# Altium project sigjumper-bottom.PrjPcb
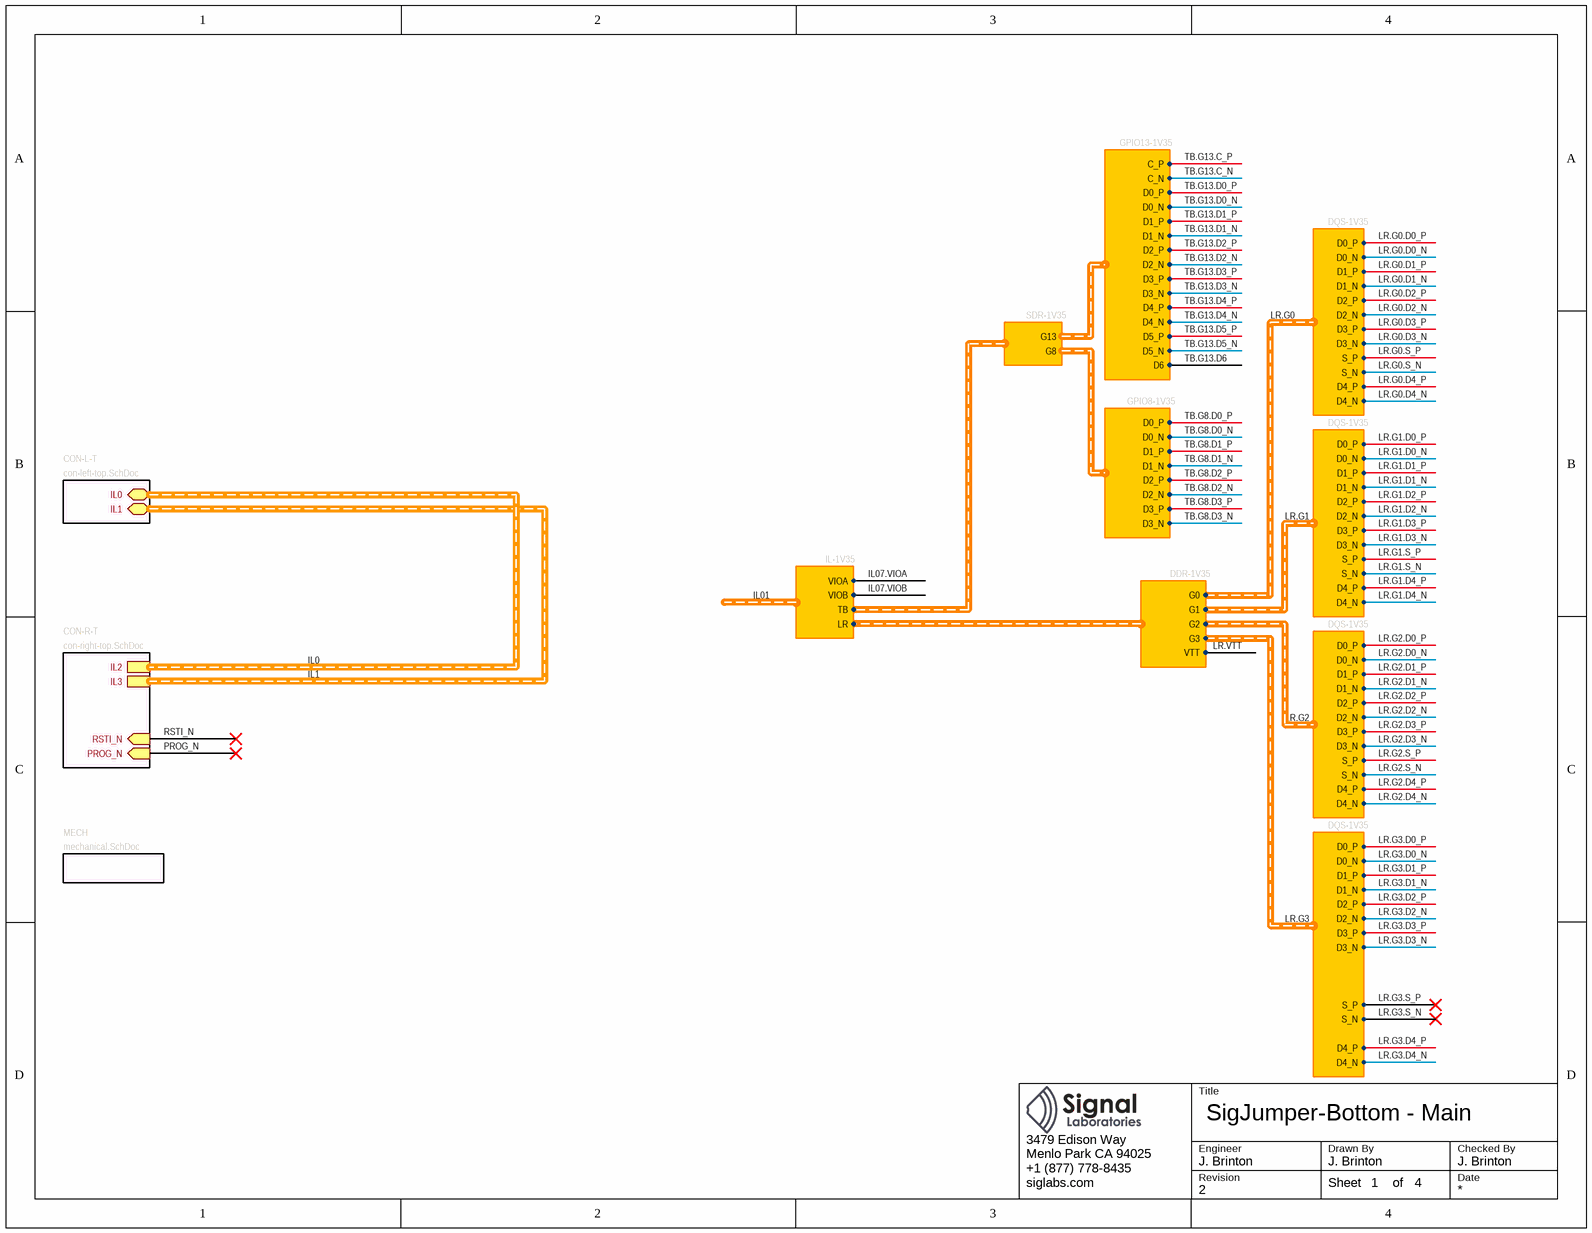
[diagram p0: main.SchDoc]
4 sheets, 24 parts. Net scope: hierarchical (ports join the sheet entries above them; power ports are global).
Board file: sigjumper-bottom.PcbDoc
Sheets:
  main.SchDoc
    CON-L-T = con-left-top.SchDoc
    CON-R-T = con-right-top.SchDoc
    MECH = mechanical.SchDoc

## Sheet main.SchDoc: SigJumper-Bottom - Main
size Letter; CheckedBy: J. Brinton; CompanyName: Signal Laboratories, Inc.; DrawnBy: J. Brinton; Engineer: J. Brinton; Address1: 3479 Edison Way; Address2: Menlo Park CA 94025; Address3: +1 (877) 778-8435; Address4: siglabs.com; Revision: 2; SheetNumber: 1; SheetTotal: 4

### Sub-sheets
CON-L-T = con-left-top.SchDoc: IL0 (harness IL-1V35), IL1 (harness IL-1V35)
CON-R-T = con-right-top.SchDoc: IL3 (harness IL-1V35), RSTI_N (in), PROG_N (in), IL2 (harness IL-1V35)
MECH = mechanical.SchDoc: no entries

### Harnesses
GPIO8-1V35: D0_P, D0_N, D1_P, D1_N, D2_P, D2_N, D3_P, D3_N
SDR-1V35: G13, G8
GPIO13-1V35: C_P, C_N, D0_P, D0_N, D1_P, D1_N, D2_P, D2_N, D3_P, D3_N, D4_P, D4_N, D5_P, D5_N, D6
DQS-1V35: D0_P, D0_N, D1_P, D1_N, D2_P, D2_N, D3_P, D3_N, D4_P, D4_N, S_P, S_N
DDR-1V35: G0, G1, G2, G3, VTT
IL-1V35: LR, TB, VIOA, VIOB

### Nets
IL07.VIOA: harness IL-1V35.VIOA  [project net IL01.VIOA]
IL07.VIOB: harness IL-1V35.VIOB  [project net IL01.VIOB]
LR.G0.D0_N: harness DQS-1V35.D0_N
LR.G0.D0_P: harness DQS-1V35.D0_P
LR.G0.D1_N: harness DQS-1V35.D1_N
LR.G0.D1_P: harness DQS-1V35.D1_P
LR.G0.D2_N: harness DQS-1V35.D2_N
LR.G0.D2_P: harness DQS-1V35.D2_P
LR.G0.D3_N: harness DQS-1V35.D3_N
LR.G0.D3_P: harness DQS-1V35.D3_P
LR.G0.D4_N: harness DQS-1V35.D4_N
LR.G0.D4_P: harness DQS-1V35.D4_P
LR.G0.S_N: harness DQS-1V35.S_N
LR.G0.S_P: harness DQS-1V35.S_P
LR.G1.D0_N: harness DQS-1V35.D0_N
LR.G1.D0_P: harness DQS-1V35.D0_P
LR.G1.D1_N: harness DQS-1V35.D1_N
LR.G1.D1_P: harness DQS-1V35.D1_P
LR.G1.D2_N: harness DQS-1V35.D2_N
LR.G1.D2_P: harness DQS-1V35.D2_P
LR.G1.D3_N: harness DQS-1V35.D3_N
LR.G1.D3_P: harness DQS-1V35.D3_P
LR.G1.D4_N: harness DQS-1V35.D4_N
LR.G1.D4_P: harness DQS-1V35.D4_P
LR.G1.S_N: harness DQS-1V35.S_N
LR.G1.S_P: harness DQS-1V35.S_P
LR.G2.D0_N: harness DQS-1V35.D0_N
LR.G2.D0_P: harness DQS-1V35.D0_P
LR.G2.D1_N: harness DQS-1V35.D1_N
LR.G2.D1_P: harness DQS-1V35.D1_P
LR.G2.D2_N: harness DQS-1V35.D2_N
LR.G2.D2_P: harness DQS-1V35.D2_P
LR.G2.D3_N: harness DQS-1V35.D3_N
LR.G2.D3_P: harness DQS-1V35.D3_P
LR.G2.D4_N: harness DQS-1V35.D4_N
LR.G2.D4_P: harness DQS-1V35.D4_P
LR.G2.S_N: harness DQS-1V35.S_N
LR.G2.S_P: harness DQS-1V35.S_P
LR.G3.D0_N: harness DQS-1V35.D0_N
LR.G3.D0_P: harness DQS-1V35.D0_P
LR.G3.D1_N: harness DQS-1V35.D1_N
LR.G3.D1_P: harness DQS-1V35.D1_P
LR.G3.D2_N: harness DQS-1V35.D2_N
LR.G3.D2_P: harness DQS-1V35.D2_P
LR.G3.D3_N: harness DQS-1V35.D3_N
LR.G3.D3_P: harness DQS-1V35.D3_P
LR.G3.D4_N: harness DQS-1V35.D4_N
LR.G3.D4_P: harness DQS-1V35.D4_P
LR.G3.S_N: harness DQS-1V35.S_N
LR.G3.S_P: harness DQS-1V35.S_P
LR.VTT: harness DDR-1V35.VTT
TB.G8.D0_N: harness GPIO8-1V35.D0_N
TB.G8.D0_P: harness GPIO8-1V35.D0_P
TB.G8.D1_N: harness GPIO8-1V35.D1_N
TB.G8.D1_P: harness GPIO8-1V35.D1_P
TB.G8.D2_N: harness GPIO8-1V35.D2_N
TB.G8.D2_P: harness GPIO8-1V35.D2_P
TB.G8.D3_N: harness GPIO8-1V35.D3_N
TB.G8.D3_P: harness GPIO8-1V35.D3_P
TB.G13.C_N: harness GPIO13-1V35.C_N
TB.G13.C_P: harness GPIO13-1V35.C_P
TB.G13.D0_N: harness GPIO13-1V35.D0_N
TB.G13.D0_P: harness GPIO13-1V35.D0_P
TB.G13.D1_N: harness GPIO13-1V35.D1_N
TB.G13.D1_P: harness GPIO13-1V35.D1_P
TB.G13.D2_N: harness GPIO13-1V35.D2_N
TB.G13.D2_P: harness GPIO13-1V35.D2_P
TB.G13.D3_N: harness GPIO13-1V35.D3_N
TB.G13.D3_P: harness GPIO13-1V35.D3_P
TB.G13.D4_N: harness GPIO13-1V35.D4_N
TB.G13.D4_P: harness GPIO13-1V35.D4_P
TB.G13.D5_N: harness GPIO13-1V35.D5_N
TB.G13.D5_P: harness GPIO13-1V35.D5_P
TB.G13.D6: harness GPIO13-1V35.D6

### Buses and harness runs
harness IL0 = sheet CON-L-T/IL0 = sheet CON-R-T/IL2
harness IL1 = sheet CON-L-T/IL1 = sheet CON-R-T/IL3

### Notes on the sheet
- Title
- Engineer
- Revision
- Drawn By
- Checked By
- Date
- Sheet
- of

## Sheet con-left-top.SchDoc: SigJumper-Bottom - Left Top
size Letter; CheckedBy: J. Brinton; CompanyName: Signal Laboratories, Inc.; DrawnBy: J. Brinton; Engineer: J. Brinton; Address1: 3479 Edison Way; Address2: Menlo Park CA 94025; Address3: +1 (877) 778-8435; Address4: siglabs.com; Revision: 2; SheetNumber: 4; SheetTotal: 4
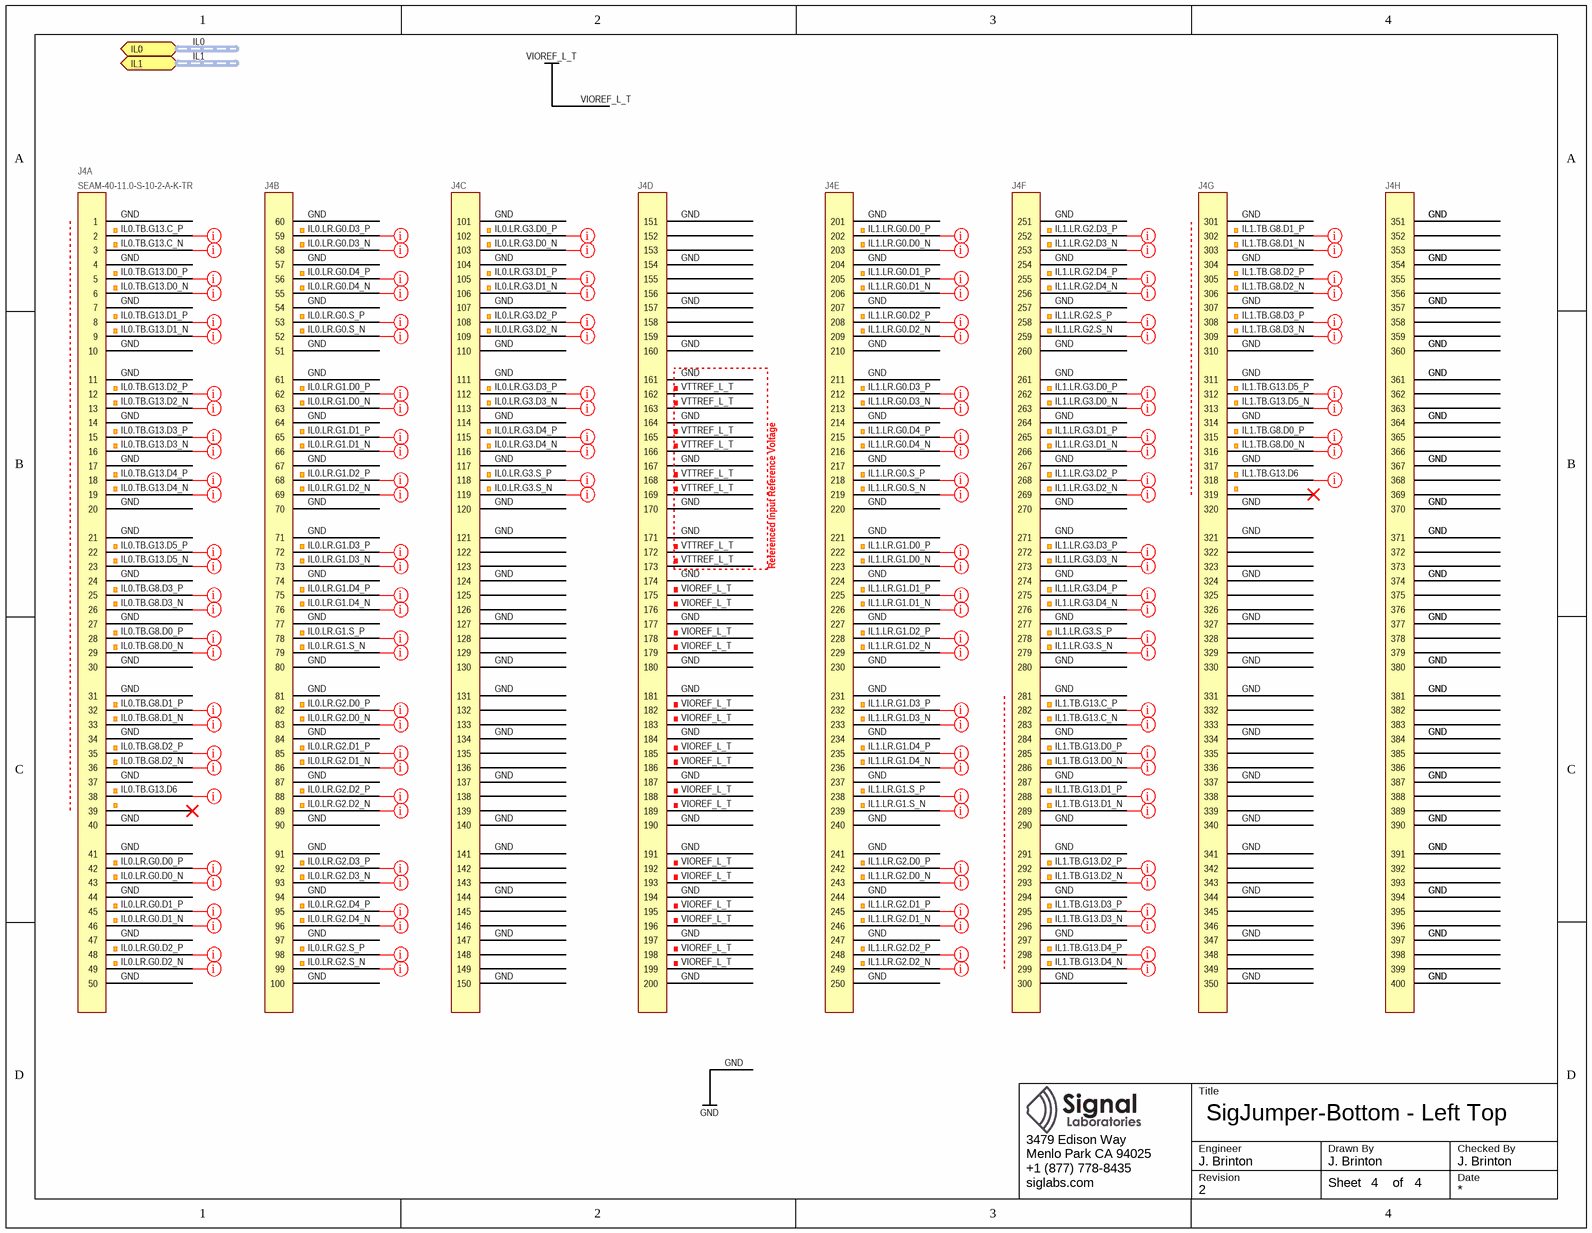
[diagram p1: con-left-top.SchDoc]

### Parts
J4  SEAM-40-11.0-S-10-2-A-K-TR  [SEAM-40-11.0-S-10-2-A-K-TR]  (parts A,B,C,D,E,F,G,H of 8)

### Ports
IL0 (harness IL-1V35), IL1 (harness IL-1V35)

### Nets
GND: J4.1 J4.4 J4.7 J4.10 J4.11 J4.14 J4.17 J4.20 J4.21 J4.24 J4.27 J4.30 J4.31 J4.34 J4.37 J4.40 J4.41 J4.44 J4.47 J4.50 J4.51 J4.54 J4.57 J4.60 J4.61 J4.64 J4.67 J4.70 J4.71 J4.74 J4.77 J4.80 J4.81 J4.84 J4.87 J4.90 J4.91 J4.94 J4.97 J4.100 J4.101 J4.104 J4.107 J4.110 J4.111 J4.114 J4.117 J4.120 J4.121 J4.124 J4.127 J4.130 J4.131 J4.134 J4.137 J4.140 J4.141 J4.144 J4.147 J4.150 J4.151 J4.154 J4.157 J4.160 J4.161 J4.164 J4.167 J4.170 J4.171 J4.174 J4.177 J4.180 J4.181 J4.184 J4.187 J4.190 J4.191 J4.194 J4.197 J4.200 J4.201 J4.204 J4.207 J4.210 J4.211 J4.214 J4.217 J4.220 J4.221 J4.224 J4.227 J4.230 J4.231 J4.234 J4.237 J4.240 J4.241 J4.244 J4.247 J4.250 J4.251 J4.254 J4.257 J4.260 J4.261 J4.264 J4.267 J4.270 J4.271 J4.274 J4.277 J4.280 J4.281 J4.284 J4.287 J4.290 J4.291 J4.294 J4.297 J4.300 J4.301 J4.304 J4.307 J4.310 J4.311 J4.314 J4.317 J4.320 J4.321 J4.324 J4.327 J4.330 J4.331 J4.334 J4.337 J4.340 J4.341 J4.344 J4.347 J4.350 J4.351 J4.354 J4.357 J4.360 J4.361 J4.364 J4.367 J4.370 J4.371 J4.374 J4.377 J4.380 J4.381 J4.384 J4.387 J4.390 J4.391 J4.394 J4.397 J4.400
VIOREF_L_T: J4.175 J4.176 J4.178 J4.179 J4.182 J4.183 J4.185 J4.186 J4.188 J4.189 J4.192 J4.193 J4.195 J4.196 J4.198 J4.199
IL0.LR.G0.D0_N: J4.43
IL0.LR.G0.D0_P: J4.42
IL0.LR.G0.D1_N: J4.46
IL0.LR.G0.D1_P: J4.45
IL0.LR.G0.D2_N: J4.49
IL0.LR.G0.D2_P: J4.48
IL0.LR.G0.D3_N: J4.58
IL0.LR.G0.D3_P: J4.59
IL0.LR.G0.D4_N: J4.55
IL0.LR.G0.D4_P: J4.56
IL0.LR.G0.S_N: J4.52
IL0.LR.G0.S_P: J4.53
IL0.LR.G1.D0_N: J4.63
IL0.LR.G1.D0_P: J4.62
IL0.LR.G1.D1_N: J4.66
IL0.LR.G1.D1_P: J4.65
IL0.LR.G1.D2_N: J4.69
IL0.LR.G1.D2_P: J4.68
IL0.LR.G1.D3_N: J4.73
IL0.LR.G1.D3_P: J4.72
IL0.LR.G1.D4_N: J4.76
IL0.LR.G1.D4_P: J4.75
IL0.LR.G1.S_N: J4.79
IL0.LR.G1.S_P: J4.78
IL0.LR.G2.D0_N: J4.83
IL0.LR.G2.D0_P: J4.82
IL0.LR.G2.D1_N: J4.86
IL0.LR.G2.D1_P: J4.85
IL0.LR.G2.D2_N: J4.89
IL0.LR.G2.D2_P: J4.88
IL0.LR.G2.D3_N: J4.93
IL0.LR.G2.D3_P: J4.92
IL0.LR.G2.D4_N: J4.96
IL0.LR.G2.D4_P: J4.95
IL0.LR.G2.S_N: J4.99
IL0.LR.G2.S_P: J4.98
IL0.LR.G3.D0_N: J4.103
IL0.LR.G3.D0_P: J4.102
IL0.LR.G3.D1_N: J4.106
IL0.LR.G3.D1_P: J4.105
IL0.LR.G3.D2_N: J4.109
IL0.LR.G3.D2_P: J4.108
IL0.LR.G3.D3_N: J4.113
IL0.LR.G3.D3_P: J4.112
IL0.LR.G3.D4_N: J4.116
IL0.LR.G3.D4_P: J4.115
IL0.LR.G3.S_N: J4.119
IL0.LR.G3.S_P: J4.118
IL0.TB.G8.D0_N: J4.29
IL0.TB.G8.D0_P: J4.28
IL0.TB.G8.D1_N: J4.33
IL0.TB.G8.D1_P: J4.32
IL0.TB.G8.D2_N: J4.36
IL0.TB.G8.D2_P: J4.35
IL0.TB.G8.D3_N: J4.26
IL0.TB.G8.D3_P: J4.25
IL0.TB.G13.C_N: J4.3
IL0.TB.G13.C_P: J4.2
IL0.TB.G13.D0_N: J4.6
IL0.TB.G13.D0_P: J4.5
IL0.TB.G13.D1_N: J4.9
IL0.TB.G13.D1_P: J4.8
IL0.TB.G13.D2_N: J4.13
IL0.TB.G13.D2_P: J4.12
IL0.TB.G13.D3_N: J4.16
IL0.TB.G13.D3_P: J4.15
IL0.TB.G13.D4_N: J4.19
IL0.TB.G13.D4_P: J4.18
IL0.TB.G13.D5_N: J4.23
IL0.TB.G13.D5_P: J4.22
IL0.TB.G13.D6: J4.38
IL1.LR.G0.D0_N: J4.203
IL1.LR.G0.D0_P: J4.202
IL1.LR.G0.D1_N: J4.206
IL1.LR.G0.D1_P: J4.205
IL1.LR.G0.D2_N: J4.209
IL1.LR.G0.D2_P: J4.208
IL1.LR.G0.D3_N: J4.213
IL1.LR.G0.D3_P: J4.212
IL1.LR.G0.D4_N: J4.216
IL1.LR.G0.D4_P: J4.215
IL1.LR.G0.S_N: J4.219
IL1.LR.G0.S_P: J4.218
IL1.LR.G1.D0_N: J4.223
IL1.LR.G1.D0_P: J4.222
IL1.LR.G1.D1_N: J4.226
IL1.LR.G1.D1_P: J4.225
IL1.LR.G1.D2_N: J4.229
IL1.LR.G1.D2_P: J4.228
IL1.LR.G1.D3_N: J4.233
IL1.LR.G1.D3_P: J4.232
IL1.LR.G1.D4_N: J4.236
IL1.LR.G1.D4_P: J4.235
IL1.LR.G1.S_N: J4.239
IL1.LR.G1.S_P: J4.238
IL1.LR.G2.D0_N: J4.243
IL1.LR.G2.D0_P: J4.242
IL1.LR.G2.D1_N: J4.246
IL1.LR.G2.D1_P: J4.245
IL1.LR.G2.D2_N: J4.249
IL1.LR.G2.D2_P: J4.248
IL1.LR.G2.D3_N: J4.253
IL1.LR.G2.D3_P: J4.252
IL1.LR.G2.D4_N: J4.256
IL1.LR.G2.D4_P: J4.255
IL1.LR.G2.S_N: J4.259
IL1.LR.G2.S_P: J4.258
IL1.LR.G3.D0_N: J4.263
IL1.LR.G3.D0_P: J4.262
IL1.LR.G3.D1_N: J4.266
IL1.LR.G3.D1_P: J4.265
IL1.LR.G3.D2_N: J4.269
IL1.LR.G3.D2_P: J4.268
IL1.LR.G3.D3_N: J4.273
IL1.LR.G3.D3_P: J4.272
IL1.LR.G3.D4_N: J4.276
IL1.LR.G3.D4_P: J4.275
IL1.LR.G3.S_N: J4.279
IL1.LR.G3.S_P: J4.278
IL1.TB.G8.D0_N: J4.316
IL1.TB.G8.D0_P: J4.315
IL1.TB.G8.D1_N: J4.303
IL1.TB.G8.D1_P: J4.302
IL1.TB.G8.D2_N: J4.306
IL1.TB.G8.D2_P: J4.305
IL1.TB.G8.D3_N: J4.309
IL1.TB.G8.D3_P: J4.308
IL1.TB.G13.C_N: J4.283
IL1.TB.G13.C_P: J4.282
IL1.TB.G13.D0_N: J4.286
IL1.TB.G13.D0_P: J4.285
IL1.TB.G13.D1_N: J4.289
IL1.TB.G13.D1_P: J4.288
IL1.TB.G13.D2_N: J4.293
IL1.TB.G13.D2_P: J4.292
IL1.TB.G13.D3_N: J4.296
IL1.TB.G13.D3_P: J4.295
IL1.TB.G13.D4_N: J4.299
IL1.TB.G13.D4_P: J4.298
IL1.TB.G13.D5_N: J4.313
IL1.TB.G13.D5_P: J4.312
IL1.TB.G13.D6: J4.318
VTTREF_L_T: J4.162 J4.163 J4.165 J4.166 J4.168 J4.169 J4.172 J4.173

Not connected (* = marked no-connect by the designer): J4 39* 122 123 125 126 128 129 132 133 135 136 138 139 142 143 145 146 148 149 152 153 155 156 158 159 319* 322 323 325 326 328 329 332 333 335 336 338 339 342 343 345 346 348 349 352 353 355 356 358 359 362 363 365 366 368 369 372 373 375 376 378 379 382 383 385 386 388 389 392 393 395 396 398 399

### Buses and harness runs
harness IL0 = port IL0
harness IL1 = port IL1

### Layout directives
net class z50; differential pair; net class loose: IL0.LR.G0.D0_N, IL0.LR.G0.D0_P, IL0.LR.G0.D1_N, IL0.LR.G0.D1_P, IL0.LR.G0.D2_N, IL0.LR.G0.D2_P, IL0.LR.G0.D3_N, IL0.LR.G0.D3_P, IL0.LR.G0.D4_N, IL0.LR.G0.D4_P, IL0.LR.G0.S_N, IL0.LR.G0.S_P, IL0.LR.G1.D0_N, IL0.LR.G1.D0_P, IL0.LR.G1.D1_N, IL0.LR.G1.D1_P, IL0.LR.G1.D2_N, IL0.LR.G1.D2_P, IL0.LR.G1.D3_N, IL0.LR.G1.D3_P, IL0.LR.G1.D4_N, IL0.LR.G1.D4_P, IL0.LR.G1.S_N, IL0.LR.G1.S_P, IL0.LR.G2.D0_N, IL0.LR.G2.D0_P, IL0.LR.G2.D1_N, IL0.LR.G2.D1_P, IL0.LR.G2.D2_N, IL0.LR.G2.D2_P, IL0.LR.G2.D3_N, IL0.LR.G2.D3_P, IL0.LR.G2.D4_N, IL0.LR.G2.D4_P, IL0.LR.G2.S_N, IL0.LR.G2.S_P, IL0.LR.G3.D0_N, IL0.LR.G3.D0_P, IL0.LR.G3.D1_N, IL0.LR.G3.D1_P, IL0.LR.G3.D2_N, IL0.LR.G3.D2_P, IL0.LR.G3.D3_N, IL0.LR.G3.D3_P, IL0.LR.G3.D4_N, IL0.LR.G3.D4_P, IL0.LR.G3.S_N, IL0.LR.G3.S_P, IL0.TB.G8.D0_N, IL0.TB.G8.D0_P, IL0.TB.G8.D1_N, IL0.TB.G8.D1_P, IL0.TB.G8.D2_N, IL0.TB.G8.D2_P, IL0.TB.G8.D3_N, IL0.TB.G8.D3_P, IL0.TB.G13.C_N, IL0.TB.G13.C_P, IL0.TB.G13.D0_N, IL0.TB.G13.D0_P, IL0.TB.G13.D1_N, IL0.TB.G13.D1_P, IL0.TB.G13.D2_N, IL0.TB.G13.D2_P, IL0.TB.G13.D3_N, IL0.TB.G13.D3_P, IL0.TB.G13.D4_N, IL0.TB.G13.D4_P, IL0.TB.G13.D5_N, IL0.TB.G13.D5_P, IL1.LR.G0.D0_N, IL1.LR.G0.D0_P, IL1.LR.G0.D1_N, IL1.LR.G0.D1_P, IL1.LR.G0.D2_N, IL1.LR.G0.D2_P, IL1.LR.G0.D3_N, IL1.LR.G0.D3_P, IL1.LR.G0.D4_N, IL1.LR.G0.D4_P, IL1.LR.G0.S_N, IL1.LR.G0.S_P, IL1.LR.G1.D0_N, IL1.LR.G1.D0_P, IL1.LR.G1.D1_N, IL1.LR.G1.D1_P, IL1.LR.G1.D2_N, IL1.LR.G1.D2_P, IL1.LR.G1.D3_N, IL1.LR.G1.D3_P, IL1.LR.G1.D4_N, IL1.LR.G1.D4_P, IL1.LR.G1.S_N, IL1.LR.G1.S_P, IL1.LR.G2.D0_N, IL1.LR.G2.D0_P, IL1.LR.G2.D1_N, IL1.LR.G2.D1_P, IL1.LR.G2.D2_N, IL1.LR.G2.D2_P, IL1.LR.G2.D3_N, IL1.LR.G2.D3_P, IL1.LR.G2.D4_N, IL1.LR.G2.D4_P, IL1.LR.G2.S_N, IL1.LR.G2.S_P, IL1.LR.G3.D0_N, IL1.LR.G3.D0_P, IL1.LR.G3.D1_N, IL1.LR.G3.D1_P, IL1.LR.G3.D2_N, IL1.LR.G3.D2_P, IL1.LR.G3.D3_N, IL1.LR.G3.D3_P, IL1.LR.G3.D4_N, IL1.LR.G3.D4_P, IL1.LR.G3.S_N, IL1.LR.G3.S_P, IL1.TB.G8.D0_N, IL1.TB.G8.D0_P, IL1.TB.G8.D1_N, IL1.TB.G8.D1_P, IL1.TB.G8.D2_N, IL1.TB.G8.D2_P, IL1.TB.G8.D3_N, IL1.TB.G8.D3_P, IL1.TB.G13.C_N, IL1.TB.G13.C_P, IL1.TB.G13.D0_N, IL1.TB.G13.D0_P, IL1.TB.G13.D1_N, IL1.TB.G13.D1_P, IL1.TB.G13.D2_N, IL1.TB.G13.D2_P, IL1.TB.G13.D3_N, IL1.TB.G13.D3_P, IL1.TB.G13.D4_N, IL1.TB.G13.D4_P, IL1.TB.G13.D5_N, IL1.TB.G13.D5_P
net class z50: IL0.TB.G13.D6, IL1.TB.G13.D6

### Notes on the sheet
- Referenced Input Reference Voltage
- Title
- Engineer
- Revision
- Drawn By
- Checked By
- Date
- Sheet
- of

### Library data of the parts
J4 = SEAM-40-11.0-S-10-2-A-K-TR: Terminal Array Assembly, Surface Mount, 0.050" Pitch, 400 Pins; Manufacturer: Samtec; Manufacturer P/N: SEAM-40-11.0-S-10-2-A-K-TR

## Sheet con-right-top.SchDoc: SigJumper-Bottom - Right Top
size Letter; CheckedBy: J. Brinton; CompanyName: Signal Laboratories, Inc.; DrawnBy: J. Brinton; Engineer: J. Brinton; Address1: 3479 Edison Way; Address2: Menlo Park CA 94025; Address3: +1 (877) 778-8435; Address4: siglabs.com; Revision: 2; SheetNumber: 2; SheetTotal: 4
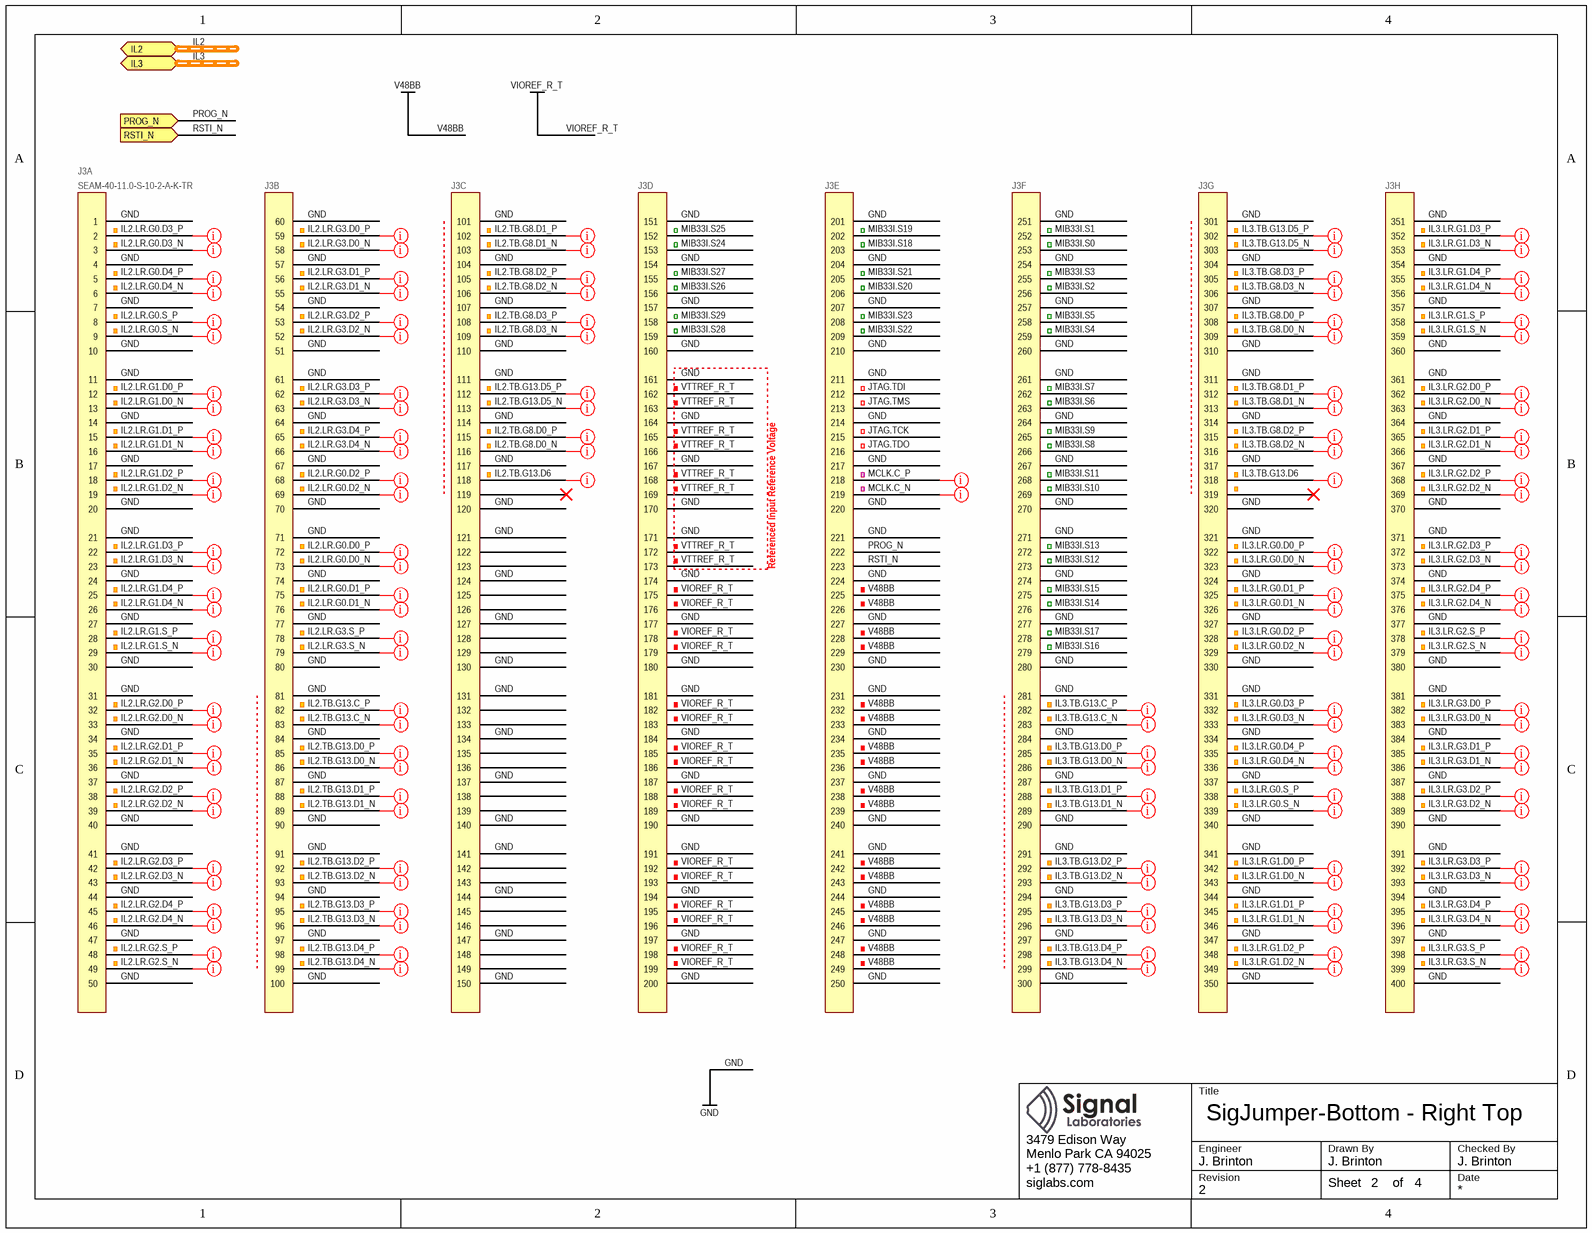
[diagram p2: con-right-top.SchDoc]

### Parts
J3  SEAM-40-11.0-S-10-2-A-K-TR  [SEAM-40-11.0-S-10-2-A-K-TR]  (parts A,B,C,D,E,F,G,H of 8)

### Ports
IL2 (harness IL-1V35), IL3 (harness IL-1V35), PROG_N (in), RSTI_N (in)

### Nets
GND: J3.1 J3.4 J3.7 J3.10 J3.11 J3.14 J3.17 J3.20 J3.21 J3.24 J3.27 J3.30 J3.31 J3.34 J3.37 J3.40 J3.41 J3.44 J3.47 J3.50 J3.51 J3.54 J3.57 J3.60 J3.61 J3.64 J3.67 J3.70 J3.71 J3.74 J3.77 J3.80 J3.81 J3.84 J3.87 J3.90 J3.91 J3.94 J3.97 J3.100 J3.101 J3.104 J3.107 J3.110 J3.111 J3.114 J3.117 J3.120 J3.121 J3.124 J3.127 J3.130 J3.131 J3.134 J3.137 J3.140 J3.141 J3.144 J3.147 J3.150 J3.151 J3.154 J3.157 J3.160 J3.161 J3.164 J3.167 J3.170 J3.171 J3.174 J3.177 J3.180 J3.181 J3.184 J3.187 J3.190 J3.191 J3.194 J3.197 J3.200 J3.201 J3.204 J3.207 J3.210 J3.211 J3.214 J3.217 J3.220 J3.221 J3.224 J3.227 J3.230 J3.231 J3.234 J3.237 J3.240 J3.241 J3.244 J3.247 J3.250 J3.251 J3.254 J3.257 J3.260 J3.261 J3.264 J3.267 J3.270 J3.271 J3.274 J3.277 J3.280 J3.281 J3.284 J3.287 J3.290 J3.291 J3.294 J3.297 J3.300 J3.301 J3.304 J3.307 J3.310 J3.311 J3.314 J3.317 J3.320 J3.321 J3.324 J3.327 J3.330 J3.331 J3.334 J3.337 J3.340 J3.341 J3.344 J3.347 J3.350 J3.351 J3.354 J3.357 J3.360 J3.361 J3.364 J3.367 J3.370 J3.371 J3.374 J3.377 J3.380 J3.381 J3.384 J3.387 J3.390 J3.391 J3.394 J3.397 J3.400
V48BB: J3.225 J3.226 J3.228 J3.229 J3.232 J3.233 J3.235 J3.236 J3.238 J3.239 J3.242 J3.243 J3.245 J3.246 J3.248 J3.249
VIOREF_R_T: J3.175 J3.176 J3.178 J3.179 J3.182 J3.183 J3.185 J3.186 J3.188 J3.189 J3.192 J3.193 J3.195 J3.196 J3.198 J3.199
IL2.LR.G0.D0_N: J3.73
IL2.LR.G0.D0_P: J3.72
IL2.LR.G0.D1_N: J3.76
IL2.LR.G0.D1_P: J3.75
IL2.LR.G0.D2_N: J3.69
IL2.LR.G0.D2_P: J3.68
IL2.LR.G0.D3_N: J3.3
IL2.LR.G0.D3_P: J3.2
IL2.LR.G0.D4_N: J3.6
IL2.LR.G0.D4_P: J3.5
IL2.LR.G0.S_N: J3.9
IL2.LR.G0.S_P: J3.8
IL2.LR.G1.D0_N: J3.13
IL2.LR.G1.D0_P: J3.12
IL2.LR.G1.D1_N: J3.16
IL2.LR.G1.D1_P: J3.15
IL2.LR.G1.D2_N: J3.19
IL2.LR.G1.D2_P: J3.18
IL2.LR.G1.D3_N: J3.23
IL2.LR.G1.D3_P: J3.22
IL2.LR.G1.D4_N: J3.26
IL2.LR.G1.D4_P: J3.25
IL2.LR.G1.S_N: J3.29
IL2.LR.G1.S_P: J3.28
IL2.LR.G2.D0_N: J3.33
IL2.LR.G2.D0_P: J3.32
IL2.LR.G2.D1_N: J3.36
IL2.LR.G2.D1_P: J3.35
IL2.LR.G2.D2_N: J3.39
IL2.LR.G2.D2_P: J3.38
IL2.LR.G2.D3_N: J3.43
IL2.LR.G2.D3_P: J3.42
IL2.LR.G2.D4_N: J3.46
IL2.LR.G2.D4_P: J3.45
IL2.LR.G2.S_N: J3.49
IL2.LR.G2.S_P: J3.48
IL2.LR.G3.D0_N: J3.58
IL2.LR.G3.D0_P: J3.59
IL2.LR.G3.D1_N: J3.55
IL2.LR.G3.D1_P: J3.56
IL2.LR.G3.D2_N: J3.52
IL2.LR.G3.D2_P: J3.53
IL2.LR.G3.D3_N: J3.63
IL2.LR.G3.D3_P: J3.62
IL2.LR.G3.D4_N: J3.66
IL2.LR.G3.D4_P: J3.65
IL2.LR.G3.S_N: J3.79
IL2.LR.G3.S_P: J3.78
IL2.TB.G8.D0_N: J3.116
IL2.TB.G8.D0_P: J3.115
IL2.TB.G8.D1_N: J3.103
IL2.TB.G8.D1_P: J3.102
IL2.TB.G8.D2_N: J3.106
IL2.TB.G8.D2_P: J3.105
IL2.TB.G8.D3_N: J3.109
IL2.TB.G8.D3_P: J3.108
IL2.TB.G13.C_N: J3.83
IL2.TB.G13.C_P: J3.82
IL2.TB.G13.D0_N: J3.86
IL2.TB.G13.D0_P: J3.85
IL2.TB.G13.D1_N: J3.89
IL2.TB.G13.D1_P: J3.88
IL2.TB.G13.D2_N: J3.93
IL2.TB.G13.D2_P: J3.92
IL2.TB.G13.D3_N: J3.96
IL2.TB.G13.D3_P: J3.95
IL2.TB.G13.D4_N: J3.99
IL2.TB.G13.D4_P: J3.98
IL2.TB.G13.D5_N: J3.113
IL2.TB.G13.D5_P: J3.112
IL2.TB.G13.D6: J3.118
IL3.LR.G0.D0_N: J3.323
IL3.LR.G0.D0_P: J3.322
IL3.LR.G0.D1_N: J3.326
IL3.LR.G0.D1_P: J3.325
IL3.LR.G0.D2_N: J3.329
IL3.LR.G0.D2_P: J3.328
IL3.LR.G0.D3_N: J3.333
IL3.LR.G0.D3_P: J3.332
IL3.LR.G0.D4_N: J3.336
IL3.LR.G0.D4_P: J3.335
IL3.LR.G0.S_N: J3.339
IL3.LR.G0.S_P: J3.338
IL3.LR.G1.D0_N: J3.343
IL3.LR.G1.D0_P: J3.342
IL3.LR.G1.D1_N: J3.346
IL3.LR.G1.D1_P: J3.345
IL3.LR.G1.D2_N: J3.349
IL3.LR.G1.D2_P: J3.348
IL3.LR.G1.D3_N: J3.353
IL3.LR.G1.D3_P: J3.352
IL3.LR.G1.D4_N: J3.356
IL3.LR.G1.D4_P: J3.355
IL3.LR.G1.S_N: J3.359
IL3.LR.G1.S_P: J3.358
IL3.LR.G2.D0_N: J3.363
IL3.LR.G2.D0_P: J3.362
IL3.LR.G2.D1_N: J3.366
IL3.LR.G2.D1_P: J3.365
IL3.LR.G2.D2_N: J3.369
IL3.LR.G2.D2_P: J3.368
IL3.LR.G2.D3_N: J3.373
IL3.LR.G2.D3_P: J3.372
IL3.LR.G2.D4_N: J3.376
IL3.LR.G2.D4_P: J3.375
IL3.LR.G2.S_N: J3.379
IL3.LR.G2.S_P: J3.378
IL3.LR.G3.D0_N: J3.383
IL3.LR.G3.D0_P: J3.382
IL3.LR.G3.D1_N: J3.386
IL3.LR.G3.D1_P: J3.385
IL3.LR.G3.D2_N: J3.389
IL3.LR.G3.D2_P: J3.388
IL3.LR.G3.D3_N: J3.393
IL3.LR.G3.D3_P: J3.392
IL3.LR.G3.D4_N: J3.396
IL3.LR.G3.D4_P: J3.395
IL3.LR.G3.S_N: J3.399
IL3.LR.G3.S_P: J3.398
IL3.TB.G8.D0_N: J3.309
IL3.TB.G8.D0_P: J3.308
IL3.TB.G8.D1_N: J3.313
IL3.TB.G8.D1_P: J3.312
IL3.TB.G8.D2_N: J3.316
IL3.TB.G8.D2_P: J3.315
IL3.TB.G8.D3_N: J3.306
IL3.TB.G8.D3_P: J3.305
IL3.TB.G13.C_N: J3.283
IL3.TB.G13.C_P: J3.282
IL3.TB.G13.D0_N: J3.286
IL3.TB.G13.D0_P: J3.285
IL3.TB.G13.D1_N: J3.289
IL3.TB.G13.D1_P: J3.288
IL3.TB.G13.D2_N: J3.293
IL3.TB.G13.D2_P: J3.292
IL3.TB.G13.D3_N: J3.296
IL3.TB.G13.D3_P: J3.295
IL3.TB.G13.D4_N: J3.299
IL3.TB.G13.D4_P: J3.298
IL3.TB.G13.D5_N: J3.303
IL3.TB.G13.D5_P: J3.302
IL3.TB.G13.D6: J3.318
JTAG.TCK: J3.215
JTAG.TDI: J3.212
JTAG.TDO: J3.216
JTAG.TMS: J3.213
MCLK.C_N: J3.219
MCLK.C_P: J3.218
MIB33I.S0: J3.253
MIB33I.S1: J3.252
MIB33I.S2: J3.256
MIB33I.S3: J3.255
MIB33I.S4: J3.259
MIB33I.S5: J3.258
MIB33I.S6: J3.263
MIB33I.S7: J3.262
MIB33I.S8: J3.266
MIB33I.S9: J3.265
MIB33I.S10: J3.269
MIB33I.S11: J3.268
MIB33I.S12: J3.273
MIB33I.S13: J3.272
MIB33I.S14: J3.276
MIB33I.S15: J3.275
MIB33I.S16: J3.279
MIB33I.S17: J3.278
MIB33I.S18: J3.203
MIB33I.S19: J3.202
MIB33I.S20: J3.206
MIB33I.S21: J3.205
MIB33I.S22: J3.209
MIB33I.S23: J3.208
MIB33I.S24: J3.153
MIB33I.S25: J3.152
MIB33I.S26: J3.156
MIB33I.S27: J3.155
MIB33I.S28: J3.159
MIB33I.S29: J3.158
PROG_N: J3.222 ; port PROG_N
RSTI_N: J3.223 ; port RSTI_N
VTTREF_R_T: J3.162 J3.163 J3.165 J3.166 J3.168 J3.169 J3.172 J3.173

Not connected (* = marked no-connect by the designer): J3 119* 122 123 125 126 128 129 132 133 135 136 138 139 142 143 145 146 148 149 319*

### Buses and harness runs
harness IL2 = port IL2
harness IL3 = port IL3

### Layout directives
net class z50: IL2.TB.G13.D6, IL3.TB.G13.D6
net class z50; differential pair; net class loose: IL2.LR.G0.D0_N, IL2.LR.G0.D0_P, IL2.LR.G0.D1_N, IL2.LR.G0.D1_P, IL2.LR.G0.D2_N, IL2.LR.G0.D2_P, IL2.LR.G0.D3_N, IL2.LR.G0.D3_P, IL2.LR.G0.D4_N, IL2.LR.G0.D4_P, IL2.LR.G0.S_N, IL2.LR.G0.S_P, IL2.LR.G1.D0_N, IL2.LR.G1.D0_P, IL2.LR.G1.D1_N, IL2.LR.G1.D1_P, IL2.LR.G1.D2_N, IL2.LR.G1.D2_P, IL2.LR.G1.D3_N, IL2.LR.G1.D3_P, IL2.LR.G1.D4_N, IL2.LR.G1.D4_P, IL2.LR.G1.S_N, IL2.LR.G1.S_P, IL2.LR.G2.D0_N, IL2.LR.G2.D0_P, IL2.LR.G2.D1_N, IL2.LR.G2.D1_P, IL2.LR.G2.D2_N, IL2.LR.G2.D2_P, IL2.LR.G2.D3_N, IL2.LR.G2.D3_P, IL2.LR.G2.D4_N, IL2.LR.G2.D4_P, IL2.LR.G2.S_N, IL2.LR.G2.S_P, IL2.LR.G3.D0_N, IL2.LR.G3.D0_P, IL2.LR.G3.D1_N, IL2.LR.G3.D1_P, IL2.LR.G3.D2_N, IL2.LR.G3.D2_P, IL2.LR.G3.D3_N, IL2.LR.G3.D3_P, IL2.LR.G3.D4_N, IL2.LR.G3.D4_P, IL2.LR.G3.S_N, IL2.LR.G3.S_P, IL2.TB.G8.D0_N, IL2.TB.G8.D0_P, IL2.TB.G8.D1_N, IL2.TB.G8.D1_P, IL2.TB.G8.D2_N, IL2.TB.G8.D2_P, IL2.TB.G8.D3_N, IL2.TB.G8.D3_P, IL2.TB.G13.C_N, IL2.TB.G13.C_P, IL2.TB.G13.D0_N, IL2.TB.G13.D0_P, IL2.TB.G13.D1_N, IL2.TB.G13.D1_P, IL2.TB.G13.D2_N, IL2.TB.G13.D2_P, IL2.TB.G13.D3_N, IL2.TB.G13.D3_P, IL2.TB.G13.D4_N, IL2.TB.G13.D4_P, IL2.TB.G13.D5_N, IL2.TB.G13.D5_P, IL3.LR.G0.D0_N, IL3.LR.G0.D0_P, IL3.LR.G0.D1_N, IL3.LR.G0.D1_P, IL3.LR.G0.D2_N, IL3.LR.G0.D2_P, IL3.LR.G0.D3_N, IL3.LR.G0.D3_P, IL3.LR.G0.D4_N, IL3.LR.G0.D4_P, IL3.LR.G0.S_N, IL3.LR.G0.S_P, IL3.LR.G1.D0_N, IL3.LR.G1.D0_P, IL3.LR.G1.D1_N, IL3.LR.G1.D1_P, IL3.LR.G1.D2_N, IL3.LR.G1.D2_P, IL3.LR.G1.D3_N, IL3.LR.G1.D3_P, IL3.LR.G1.D4_N, IL3.LR.G1.D4_P, IL3.LR.G1.S_N, IL3.LR.G1.S_P, IL3.LR.G2.D0_N, IL3.LR.G2.D0_P, IL3.LR.G2.D1_N, IL3.LR.G2.D1_P, IL3.LR.G2.D2_N, IL3.LR.G2.D2_P, IL3.LR.G2.D3_N, IL3.LR.G2.D3_P, IL3.LR.G2.D4_N, IL3.LR.G2.D4_P, IL3.LR.G2.S_N, IL3.LR.G2.S_P, IL3.LR.G3.D0_N, IL3.LR.G3.D0_P, IL3.LR.G3.D1_N, IL3.LR.G3.D1_P, IL3.LR.G3.D2_N, IL3.LR.G3.D2_P, IL3.LR.G3.D3_N, IL3.LR.G3.D3_P, IL3.LR.G3.D4_N, IL3.LR.G3.D4_P, IL3.LR.G3.S_N, IL3.LR.G3.S_P, IL3.TB.G8.D0_N, IL3.TB.G8.D0_P, IL3.TB.G8.D1_N, IL3.TB.G8.D1_P, IL3.TB.G8.D2_N, IL3.TB.G8.D2_P, IL3.TB.G8.D3_N, IL3.TB.G8.D3_P, IL3.TB.G13.C_N, IL3.TB.G13.C_P, IL3.TB.G13.D0_N, IL3.TB.G13.D0_P, IL3.TB.G13.D1_N, IL3.TB.G13.D1_P, IL3.TB.G13.D2_N, IL3.TB.G13.D2_P, IL3.TB.G13.D3_N, IL3.TB.G13.D3_P, IL3.TB.G13.D4_N, IL3.TB.G13.D4_P, IL3.TB.G13.D5_N, IL3.TB.G13.D5_P
net class z50; differential pair; net class tight: MCLK.C_N, MCLK.C_P

### Notes on the sheet
- Referenced Input Reference Voltage
- Title
- Engineer
- Revision
- Drawn By
- Checked By
- Date
- Sheet
- of

### Library data of the parts
J3 = SEAM-40-11.0-S-10-2-A-K-TR: as J4 on sheet con-left-top; Manufacturer P/N: SEAM-40-11.0-S-10-2-A-K-TR

## Sheet mechanical.SchDoc: SigJumper-Bottom - Mechanical
size Letter; CheckedBy: J. Brinton; CompanyName: Signal Laboratories, Inc.; DrawnBy: J. Brinton; Engineer: J. Brinton; Address1: 3479 Edison Way; Address2: Menlo Park CA 94025; Address3: +1 (877) 778-8435; Address4: siglabs.com; Revision: 2; SheetNumber: 3; SheetTotal: 4
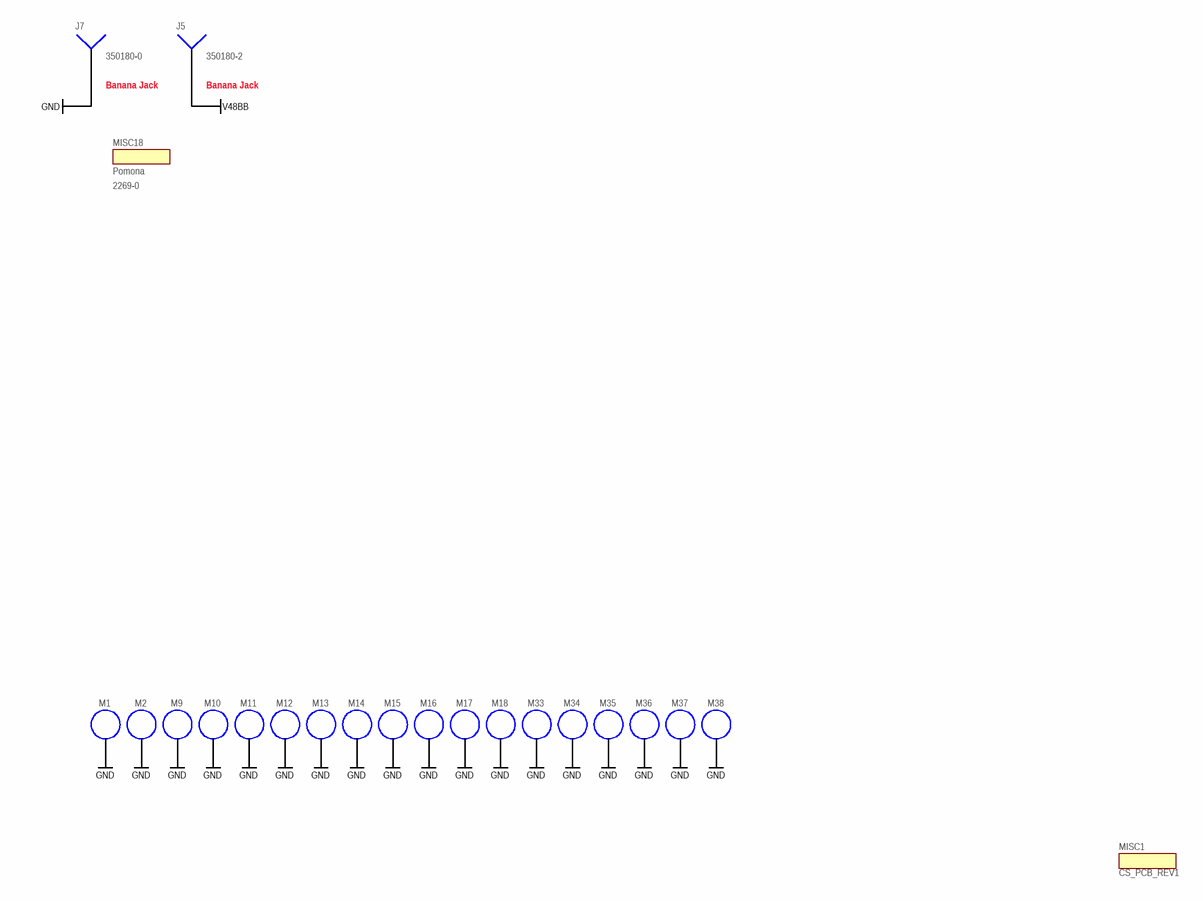
[diagram p3: mechanical.SchDoc]

### Parts
J5  350180-2  [POWER_PAD]  (no BOM)
J7  350180-0  [POWER_PAD]  (no BOM)
M1  MOUNT  [MOUNTM3]  (value not drawn)  (no BOM)
M2  MOUNT  [MOUNTM3]  (value not drawn)  (no BOM)
M9  MOUNT  [MOUNTM3]  (value not drawn)  (no BOM)
M10  MOUNT  [MOUNTM3]  (value not drawn)  (no BOM)
M11  MOUNT  [MOUNTM3]  (value not drawn)  (no BOM)
M12  MOUNT  [MOUNTM3]  (value not drawn)  (no BOM)
M13  MOUNT  [MOUNTM3]  (value not drawn)  (no BOM)
M14  MOUNT  [MOUNTM3]  (value not drawn)  (no BOM)
M15  MOUNT  [MOUNTM3]  (value not drawn)  (no BOM)
M16  MOUNT  [MOUNTM3]  (value not drawn)  (no BOM)
M17  MOUNT  [MOUNTM3]  (value not drawn)  (no BOM)
M18  MOUNT  [MOUNTM3]  (value not drawn)  (no BOM)
M33  MOUNT  [MOUNTM3]  (value not drawn)  (no BOM)
M34  MOUNT  [MOUNTM3]  (value not drawn)  (no BOM)
M35  MOUNT  [MOUNTM3]  (value not drawn)  (no BOM)
M36  MOUNT  [MOUNTM3]  (value not drawn)  (no BOM)
M37  MOUNT  [MOUNTM3]  (value not drawn)  (no BOM)
M38  MOUNT  [MOUNTM3]  (value not drawn)  (no BOM)
MISC1  CS_PCB_REV1  (mechanical)
MISC18  2269-0  Manufacturer: Pomona  (mechanical)

### Nets
GND: J7.1 M1.1(MNT) M2.1(MNT) M9.1(MNT) M10.1(MNT) M11.1(MNT) M12.1(MNT) M13.1(MNT) M14.1(MNT) M15.1(MNT) M16.1(MNT) M17.1(MNT) M18.1(MNT) M33.1(MNT) M34.1(MNT) M35.1(MNT) M36.1(MNT) M37.1(MNT) M38.1(MNT)
V48BB: J5.1

### Notes on the sheet
- Banana Jack
- (near J5) Banana Jack
- Title
- Engineer
- Revision
- Drawn By
- Checked By
- Date
- Sheet
- of

### Library data of the parts
J5 = Socket: Test Probe Assembly; Red; Manufacturer: TE Connectivity; Manufacturer P/N: 350180-2
J7 = Socket: Test Probe Assembly; Black; Manufacturer: TE Connectivity; Manufacturer P/N: 350180-0
M1 M2 M9-M18 M33-M38 = MOUNT: M3 Standard Fit Hole; Manufacturer: *; Manufacturer P/N: *
MISC1 = M50-1900005: Copper Suicide PCB; Manufacturer: Signal Laboratories, Inc.; Manufacturer P/N: CS_PCB_REV1
MISC18 = M50-1900005: Double Banana Jack Connector; Do Not Place: PURCHASE BUT DNP; Manufacturer P/N: 2269-0

## Nets that join several sheets
GND: con-left-top (160 pins), con-right-top (160 pins), mechanical (19 pins)
V48BB: con-right-top (16 pins), mechanical (J5.1)